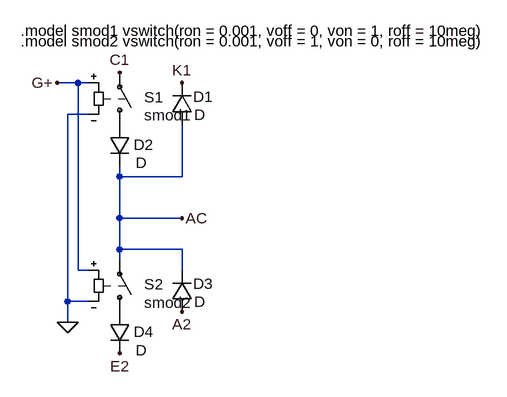
[diagram p0: schematic IDEAL_IGBT_Halfbridge.asc]
IDEAL_IGBT_Halfbridge.asc, the LTspice schematic file:
Version 4
SHEET 1 880 680
WIRE 144 96 112 96
WIRE 160 96 144 96
WIRE 160 144 128 144
WIRE 208 240 208 224
WIRE 304 240 304 160
WIRE 304 240 208 240
WIRE 208 304 208 240
WIRE 304 304 208 304
WIRE 208 352 208 304
WIRE 304 352 208 352
WIRE 208 368 208 352
WIRE 144 384 144 96
WIRE 160 384 144 384
WIRE 304 384 304 352
WIRE 128 432 128 144
WIRE 160 432 128 432
WIRE 128 464 128 432
FLAG 112 96 G+
FLAG 208 80 C1
FLAG 304 96 K1
FLAG 208 512 E2
FLAG 304 448 A2
FLAG 304 304 AC
FLAG 128 464 0
SYMBOL sw 208 176 M180
WINDOW 3 38 30 Left 0
WINDOW 0 38 58 Left 0
SYMATTR Value smod1
SYMATTR InstName S1
SYMBOL diode 320 160 R180
WINDOW 0 -32 43 Left 0
WINDOW 3 -20 15 Left 0
SYMATTR InstName D1
SYMBOL diode 192 160 R0
WINDOW 0 38 31 Left 0
WINDOW 3 41 59 Left 0
SYMATTR InstName D2
SYMBOL sw 208 464 M180
WINDOW 3 38 30 Left 0
WINDOW 0 38 58 Left 0
SYMATTR Value smod2
SYMATTR InstName S2
SYMBOL diode 320 448 R180
WINDOW 0 -32 43 Left 0
WINDOW 3 -20 15 Left 0
SYMATTR InstName D3
SYMBOL diode 192 448 R0
WINDOW 0 38 31 Left 0
WINDOW 3 41 59 Left 0
SYMATTR InstName D4
TEXT 56 16 Left 0 !.model smod1 vswitch(ron = 0.001, voff = 0, von = 1, roff = 10meg)
TEXT 56 32 Left 0 !.model smod2 vswitch(ron = 0.001, voff = 1, von = 0, roff = 10meg)

The netlist it stands for:
* IDEAL_IGBT_Halfbridge.asc
S1 P001 C1 G+ 0 smod1
D1 AC K1 D
D2 P001 AC D
S2 P002 AC G+ 0 smod2
D3 A2 AC D
D4 P002 E2 D
.model D D
.lib standard.dio
.model smod1 vswitch(ron = 0.001, voff = 0, von = 1, roff = 10meg)
.model smod2 vswitch(ron = 0.001, voff = 1, von = 0, roff = 10meg)
.backanno
.end